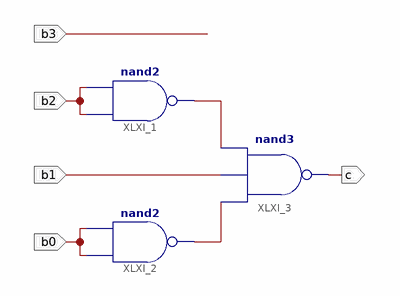
[diagram p0: schematic sheet 1]
// Xilinx ISE schematic c_block.sch (xc9500xl) as structural Verilog: 3 symbols, 5 ports
module c_block (
  input  b3,
  input  b1,
  input  b2,
  input  b0,
  output c
);

  wire XLXN_8, XLXN_9;

  nand XLXI_1 (XLXN_8, b2, b2);
  nand XLXI_2 (XLXN_9, b0, b0);
  nand XLXI_3 (c, XLXN_9, b1, XLXN_8);
endmodule
